# EAGLE design mailbox-notifier (EAGLE 9.5.1)
CNAME: PepeTech; CREVISION: 2.0; DESIGNER: Joao Silva

## Sheet 1 of 4: Power
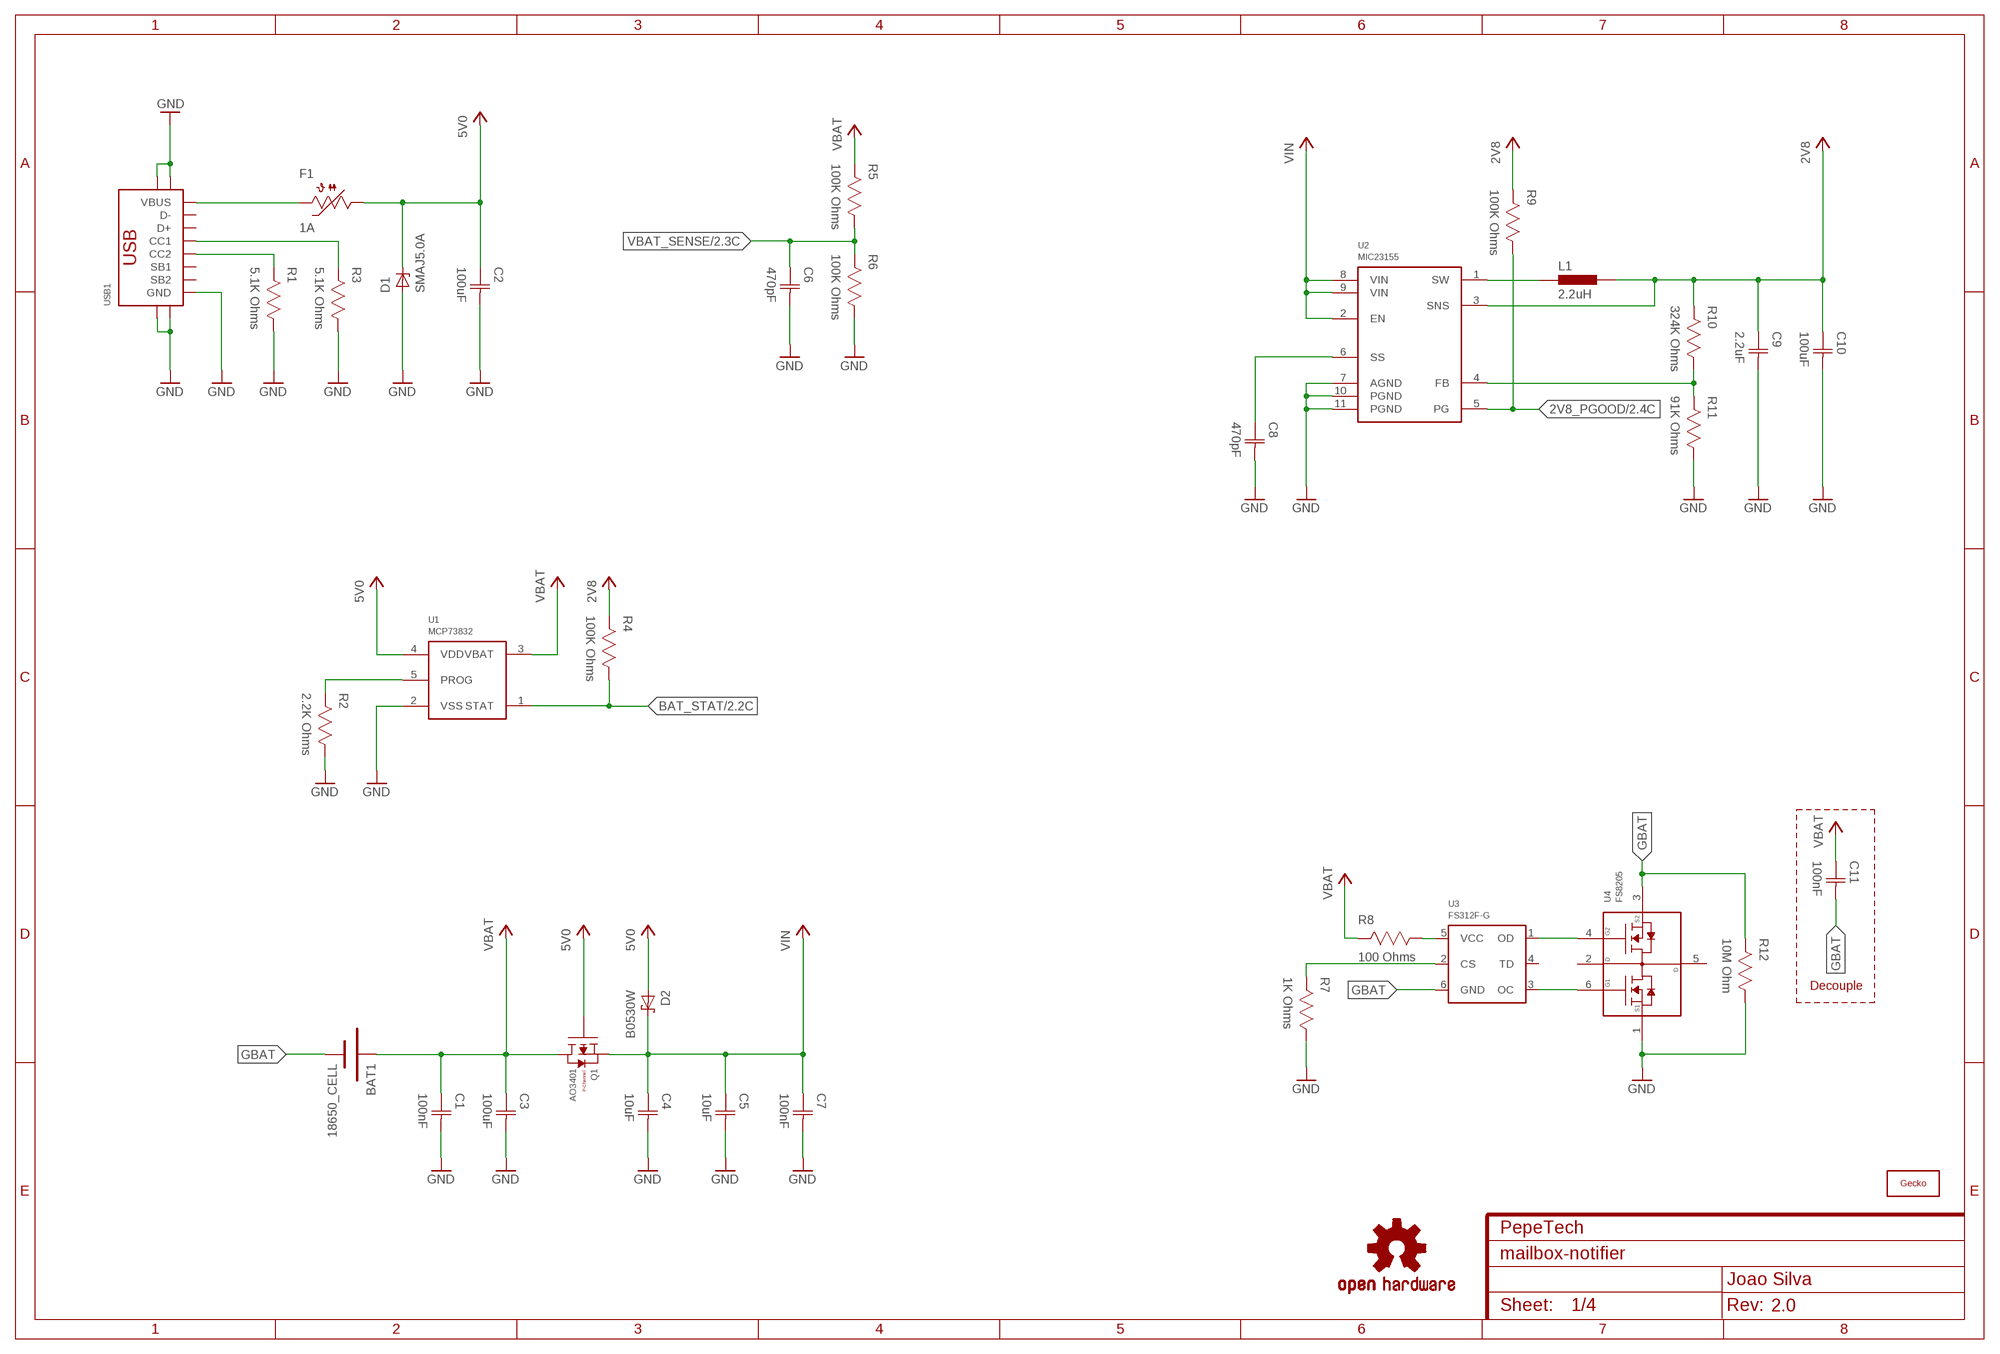
[diagram p0: schematic, sheet 1]

### Parts
BAT1  18650_CELL  [18650]
C1  100nF  CAPACITOR-0603  [CAP0603]
C2  100uF  CAPACITOR-1206  [CAP1206]
C3  100uF  CAPACITOR-1206  [CAP1206]
C4  10uF  CAPACITOR-0603  [CAP0603]
C5  10uF  CAPACITOR-0603  [CAP0603]
C6  470pF  CAPACITOR-0603  [CAP0603]
C7  100nF  CAPACITOR-0603  [CAP0603]
C8  470pF  CAPACITOR-0603  [CAP0603]
C9  2.2uF  CAPACITOR-0603  [CAP0603]
C10  100uF  CAPACITOR-1206  [CAP1206]
C11  100nF  CAPACITOR-0603  [CAP0603]
D1  SMAJ5.0A  [DO214AC]
D2  B0530W  [SOD-123]
F1  1A Hold  PTC1206  [1206]
L1  2.2uH  INDUCTOR-0805  [IND0805]
LOGO1  GECKO-14MM  [GECKO_14MM]
LOGO2  OSHW-LOGOM  [OSHW-LOGO-M]
Q1  AO3401  [SOT23]
R1  5.1K Ohms  RESISTOR-0603  [RES0603]
R2  2.2K Ohms  RESISTOR-0603  [RES0603]
R3  5.1K Ohms  RESISTOR-0603  [RES0603]
R4  100K Ohms  RESISTOR-0603  [RES0603]
R5  100K Ohms  RESISTOR-0603  [RES0603]
R6  100K Ohms  RESISTOR-0603  [RES0603]
R7  1K Ohms  RESISTOR-0603  [RES0603]
R8  100 Ohms  RESISTOR-0603  [RES0603]
R9  100K Ohms  RESISTOR-0603  [RES0603]
R10  324K Ohms  RESISTOR-0603  [RES0603]
R11  91K Ohms  RESISTOR-0603  [RES0603]
R12  10M Ohm  RESISTOR-0603  [RES0603]
U1  MCP73832  [SOT23-5]
U2  MIC23155  [DFN10]
U3  FS312F-G  [SOT23-6]
U4  FS8205  [SOT23-6]
USB1  USB-C-16P-SMD-FLAT-SIDE-TYPE-2  [USB-C-16P-SMD-FLAT-SIDE-TYPE-2]

### Nets
2V8: C9.1(C1) C10.1(C1) L1.2 R4.2 R9.2 R10.2 U2.3(SNS) ; also sheet 2,3,4
2V8_PGOOD: R9.1 U2.5(PG) ; also sheet 2
5V0: C2.1(C1) D1.C D2.A F1.1 Q1.1(G) U1.4(VDD)
BAT_STAT: R4.1 U1.1(STAT) ; also sheet 2
GBAT: BAT1.- C11.2(C2) R12.2 U3.6(GND) U4.3(S2)
GND: C1.2(C2) C2.2(C2) C3.2(C2) C4.2(C2) C5.2(C2) C6.2(C2) C7.2(C2) C8.2(C2) C9.2(C2) C10.2(C2) D1.A R1.1 R2.1 R3.1 R6.1 R7.1 R11.1 R12.1 U1.2(VSS) U2.7(AGND) U2.10(PGND) U2.11(PGND) U4.1(S1) USB1.A1/B12(GND) USB1.B1/A12(GND) USB1.SHIELD@0(SHIELD) USB1.SHIELD@1(SHIELD) USB1.SHIELD@2(SHIELD) USB1.SHIELD@3(SHIELD) ; also sheet 2,3,4
N$3: R1.2 USB1.B5(CC2)
N$4: F1.2 USB1.A4/B9(VBUS) USB1.B4/A9(VBUS)
N$5: R3.2 USB1.A5(CC1)
N$10: R2.2 U1.5(PROG)
N$12: L1.1 U2.1(SW)
N$13: R10.1 R11.2 U2.4(FB)
N$14: C8.1(C1) U2.6(SS)
N$47: U3.3(OC) U4.6(G1)
N$48: U3.1(OD) U4.4(G2)
N$49: R8.1 U3.5(VCC)
N$50: R7.2 U3.2(CS)
VBAT: BAT1.+ C1.1(C1) C3.1(C1) C11.1(C1) Q1.3(D) R5.2 R8.2 U1.3(VBAT)
VBAT_SENSE: C6.1(C1) R5.1 R6.2 ; also sheet 2
VIN: C4.1(C1) C5.1(C1) C7.1(C1) D2.C Q1.2(S) U2.2(EN) U2.8(VIN) U2.9(VIN)
Unconnected: U3.4(TD) U4.2(D12_1) U4.5(D12_2) USB1.A6(D+) USB1.A7(D-) USB1.A8(SB1) USB1.B6(D+) USB1.B7(D-) USB1.B8(SB2)

### Notes on the sheet
- Decouple

## Sheet 2 of 4: Main MCU
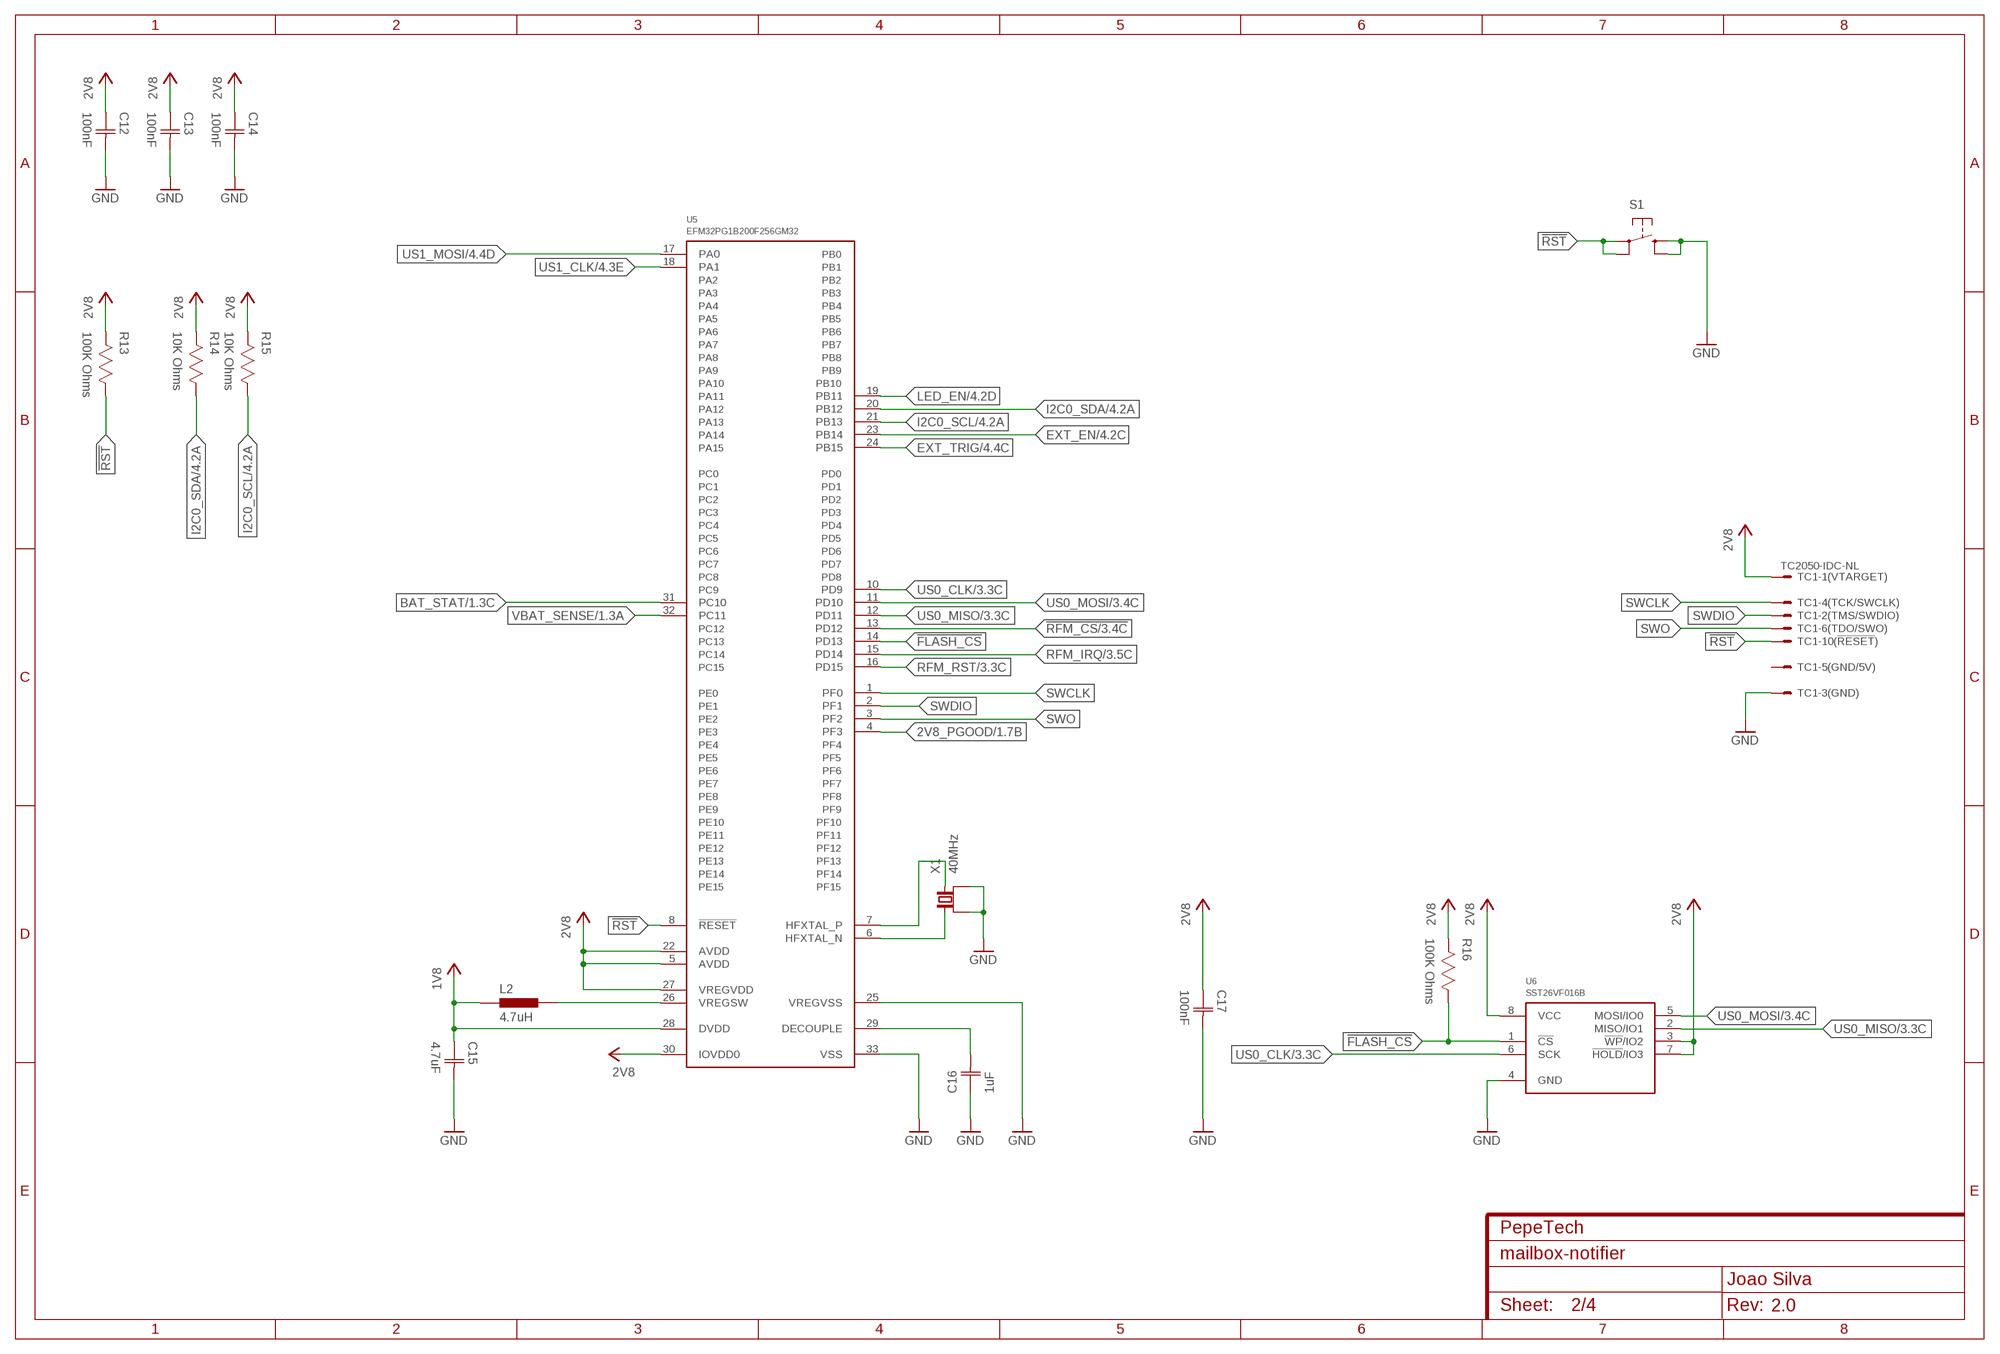
[diagram p1: schematic, sheet 2]

### Parts
C12  100nF  CAPACITOR-0603  [CAP0603]
C13  100nF  CAPACITOR-0603  [CAP0603]
C14  100nF  CAPACITOR-0603  [CAP0603]
C15  4.7uF  CAPACITOR-0603  [CAP0603]
C16  1uF  CAPACITOR-0603  [CAP0603]
C17  100nF  CAPACITOR-0603  [CAP0603]
L2  4.7uH  INDUCTOR-0603  [IND0603]
R13  100K Ohms  RESISTOR-0603  [RES0603]
R14  10K Ohms  RESISTOR-0603  [RES0603]
R15  10K Ohms  RESISTOR-0603  [RES0603]
R16  100K Ohms  RESISTOR-0603  [RES0603]
S1  TAC_SWITCHSMD  [TAC_SW_SMD_RESET]
TC1  TC2050-IDC-NL  [TC2050-IDC-NL]
U5  EFM32PG1B200F256GM32  [QFN32_0.5P]
U6  SST26VF016B  [WSOIC8]
X1  40MHz  CRYSTAL_4P  [4-SMD-3225]

### Nets
1V8: C15.1(C1) L2.1 U5.28(DVDD)
2V8: C12.1(C1) C13.1(C1) C14.1(C1) C17.1(C1) R13.2 R14.2 R15.2 R16.2 TC1.1 U5.5(AVDD) U5.22(AVDD) U5.27(VREGVDD) U5.30(IOVDD0) U6.3(!WP!/IO2) U6.7(!HOLD!/IO3) U6.8(VCC) ; also sheet 1,3,4
2V8_PGOOD: U5.4(PF3) ; also sheet 1
!FLASH_CS: R16.1 U5.14(PD13) U6.1(!CS!)
!RFM_CS: U5.13(PD12) ; also sheet 3
!RST: R13.1 S1.1 S1.2 TC1.10 U5.8(!RESET)
BAT_STAT: U5.31(PC10) ; also sheet 1
EXT_EN: U5.23(PB14) ; also sheet 4
EXT_TRIG: U5.24(PB15) ; also sheet 4
GND: C12.2(C2) C13.2(C2) C14.2(C2) C15.2(C2) C16.1(C1) C17.2(C2) S1.3 S1.4 TC1.3 U5.25(VREGVSS) U5.33(VSS) U6.4(GND) X1.1(GND) X1.3(GND) ; also sheet 1,3,4
I2C0_SCL: R15.1 U5.21(PB13) ; also sheet 4
I2C0_SDA: R14.1 U5.20(PB12) ; also sheet 4
LED_EN: U5.19(PB11) ; also sheet 4
N$16: U5.6(HFXTAL_N) X1.2
N$17: U5.7(HFXTAL_P) X1.4
N$19: L2.2 U5.26(VREGSW)
N$20: C16.2(C2) U5.29(DECOUPLE)
RFM_IRQ: U5.15(PD14) ; also sheet 3
RFM_RST: U5.16(PD15) ; also sheet 3
SWCLK: TC1.4 U5.1(PF0)
SWDIO: TC1.2 U5.2(PF1)
SWO: TC1.6 U5.3(PF2)
US0_CLK: U5.10(PD9) U6.6(SCK) ; also sheet 3
US0_MISO: U5.12(PD11) U6.2(MISO/IO1) ; also sheet 3
US0_MOSI: U5.11(PD10) U6.5(MOSI/IO0) ; also sheet 3
US1_CLK: U5.18(PA1) ; also sheet 4
US1_MOSI: U5.17(PA0) ; also sheet 4
VBAT_SENSE: U5.32(PC11) ; also sheet 1
Unconnected: TC1.5 TC1.7 TC1.8 TC1.9

## Sheet 3 of 4: ISM Radio
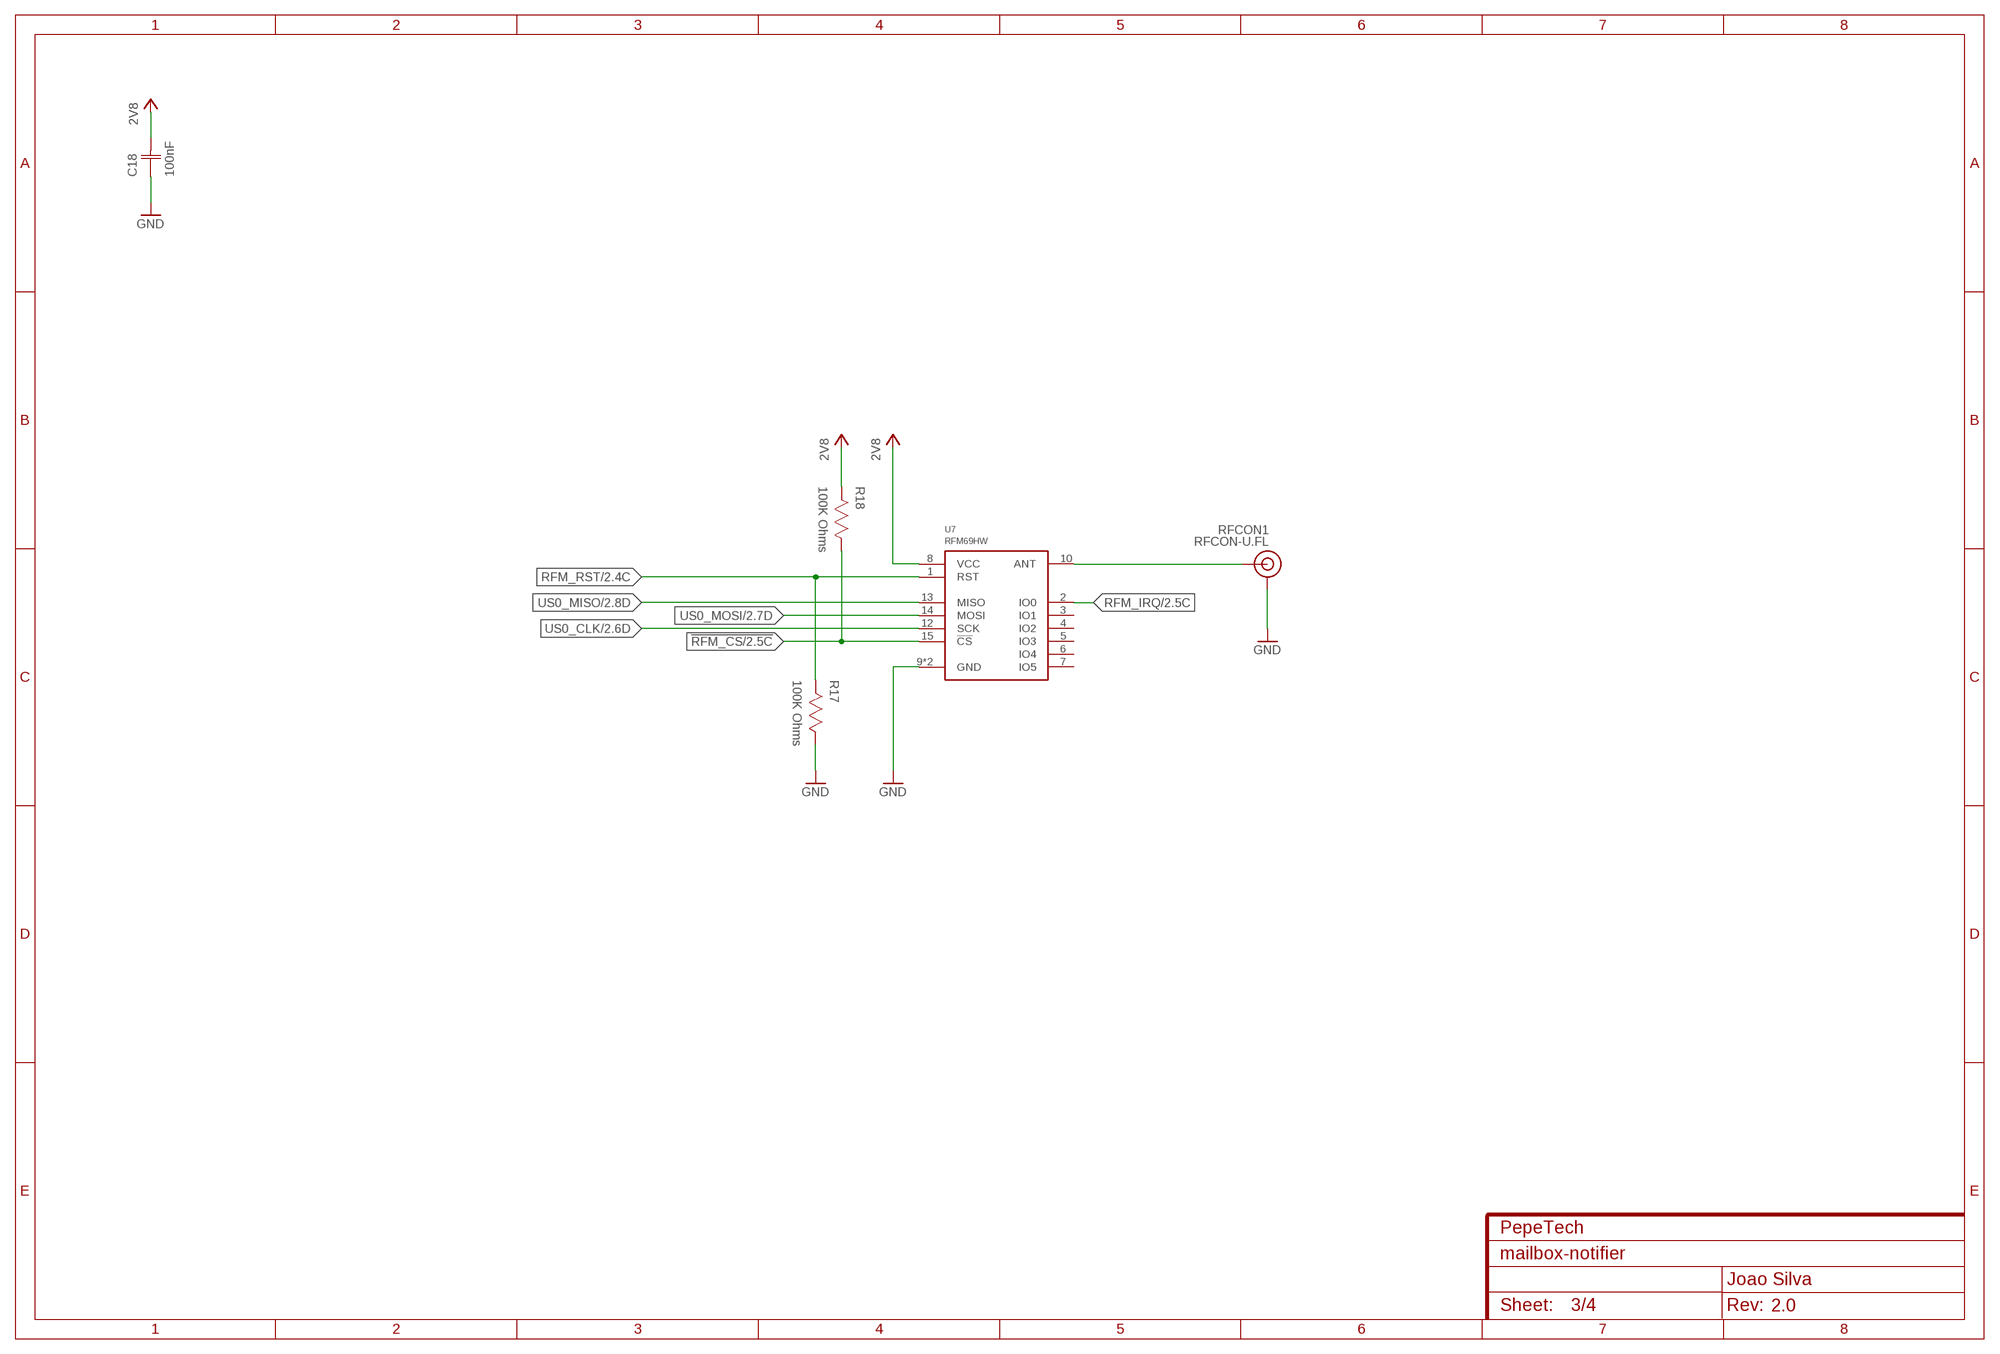
[diagram p2: schematic, sheet 3]

### Parts
C18  100nF  CAPACITOR-0603  [CAP0603]
R17  100K Ohms  RESISTOR-0603  [RES0603]
R18  100K Ohms  RESISTOR-0603  [RES0603]
RFCON1  RFCON-U.FL  [U.FL]
U7  RFM69HW  [RFM69XW-XXXS2]

### Nets
2V8: C18.2(C2) R18.2 U7.8(VCC) ; also sheet 1,2,4
!RFM_CS: R18.1 U7.15(!CS) ; also sheet 2
GND: C18.1(C1) R17.1 RFCON1.P$1(GND) RFCON1.P$2(GND) U7.9(GND) U7.11(GND) ; also sheet 1,2,4
N$1: RFCON1.P$3(SIGNAL) U7.10(ANT)
RFM_IRQ: U7.2(IO0) ; also sheet 2
RFM_RST: R17.2 U7.1(RST) ; also sheet 2
US0_CLK: U7.12(SCK) ; also sheet 2
US0_MISO: U7.13(MISO) ; also sheet 2
US0_MOSI: U7.14(MOSI) ; also sheet 2
Unconnected: U7.3(IO1) U7.4(IO2) U7.5(IO3) U7.6(IO4) U7.7(IO5)

## Sheet 4 of 4: Sensors/Interface
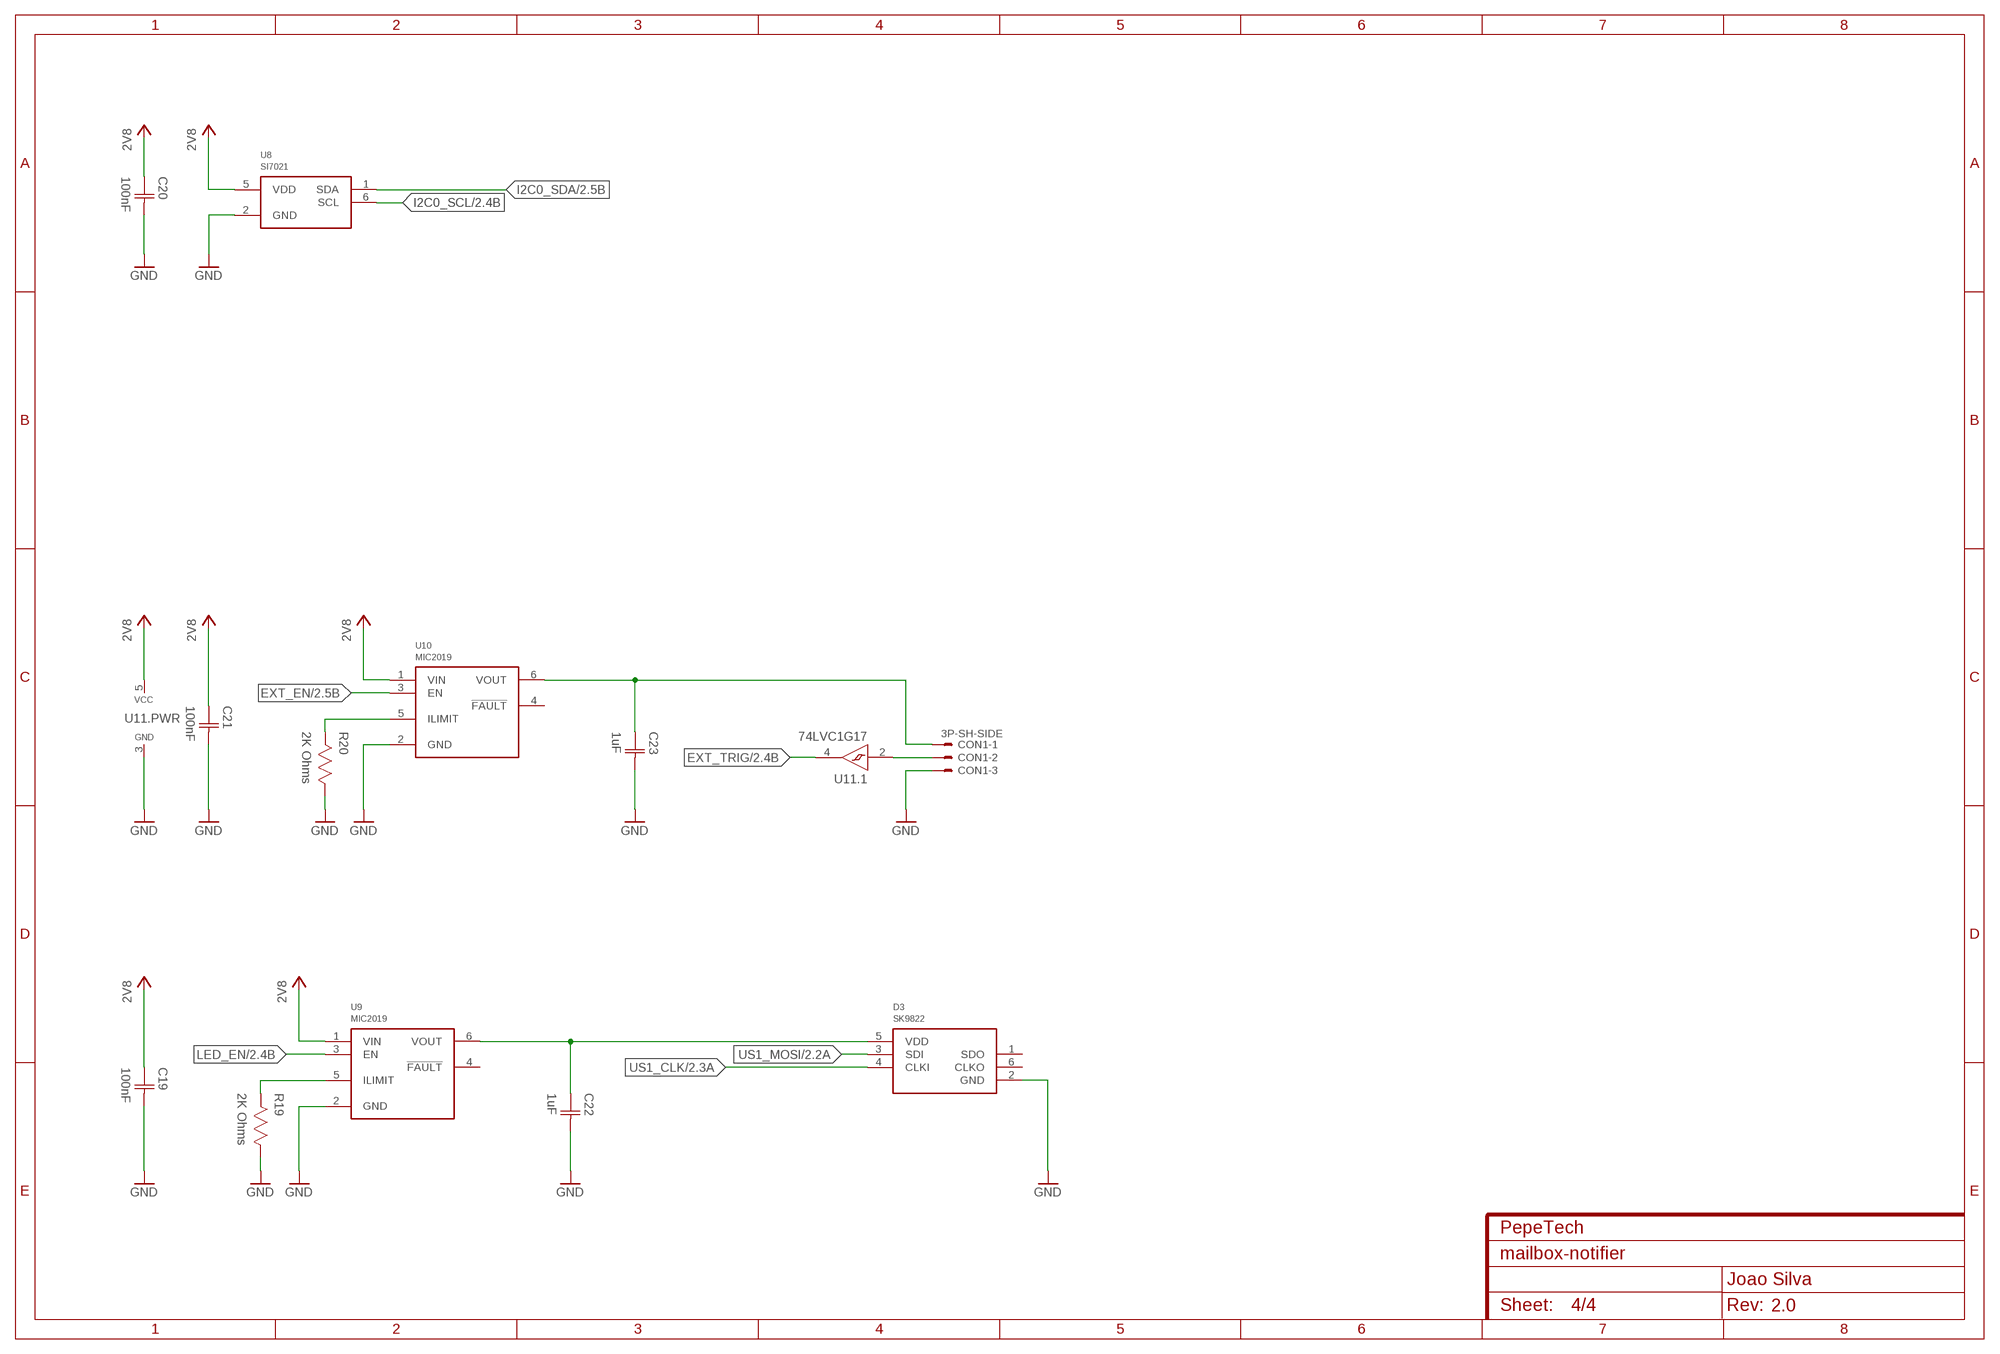
[diagram p3: schematic, sheet 4]

### Parts
C19  100nF  CAPACITOR-0603  [CAP0603]
C20  100nF  CAPACITOR-0603  [CAP0603]
C21  100nF  CAPACITOR-0603  [CAP0603]
C22  1uF  CAPACITOR-0603  [CAP0603]
C23  1uF  CAPACITOR-0603  [CAP0603]
CON1  3P-SH-SIDE  [SH-03-SIDE]
D3  SK9822  [2020]
R19  2K Ohms  RESISTOR-0603  [RES0603]
R20  2K Ohms  RESISTOR-0603  [RES0603]
U8  SI7021  [DFN6]
U9  MIC2019  [SOT23-6]
U10  MIC2019  [SOT23-6]
U11  74LVC1G17  [SC70-5]

### Nets
2V8: C19.1(C1) C20.1(C1) C21.1(C1) U8.5(VDD) U9.1(VIN) U10.1(VIN) U11.5(.PWR:VCC) ; also sheet 1,2,3
EXT_EN: U10.3(EN) ; also sheet 2
EXT_TRIG: U11.4(.1:Y) ; also sheet 2
GND: C19.2(C2) C20.2(C2) C21.2(C2) C22.2(C2) C23.2(C2) CON1.3 D3.2(GND) R19.1 R20.1 U8.2(GND) U9.2(GND) U10.2(GND) U11.3(.PWR:GND) ; also sheet 1,2,3
I2C0_SCL: U8.6(SCL) ; also sheet 2
I2C0_SDA: U8.1(SDA) ; also sheet 2
LED_EN: U9.3(EN) ; also sheet 2
N$2: R20.2 U10.5(ILIMIT)
N$6: CON1.2 U11.2(.1:A)
N$7: C23.1(C1) CON1.1 U10.6(VOUT)
N$11: R19.2 U9.5(ILIMIT)
N$15: C22.1(C1) D3.5(VDD) U9.6(VOUT)
US1_CLK: D3.4(CLKI) ; also sheet 2
US1_MOSI: D3.3(SDI) ; also sheet 2
Unconnected: D3.1(SDO) D3.6(CLKO) U9.4(!FAULT) U10.4(!FAULT)

## Library data of the parts
BAT1 = Battery:18650_CELL
C1-C23 = Capacitor:CAPACITOR
CON1 = JST:3P: Disconnectable Crimp style connector, 1.0mm pitch 3 contacts
D1 = TVS:SMAJ*A: SMAJ Series TVS Diodes Source: http://www.littelfuse.com/~/media/electronics/datasheets/tvs_diodes/littelfuse_tvs_diode_smaj_datasheet.pdf.pdf; MF: Littelfuse; MPN: SMAJ5.0A; OC_FARNELL: 1827607; OC_NEWARK: 71J2029
D2 = Generic Diode:B0530W
D3 = LED:SK9822
F1 = PTC Fuses:PTC; HOLD: 1A
L1 = Inductor:INDUCTOR; OCLCSC: C139241
L2 = Inductor:INDUCTOR; OCLCSC: C281111
LOGO1 = Silkscreen:GECKO
LOGO2 = Silkscreen:OSHW-LOGO: Open-Source Hardware (OSHW) Logo This logo indicates the piece of hardware it is found on incorporates a OSHW license and/or adheres to the definition of open source hardware found here: http://freedomdefined.org/OSHW
Q1 = Alpha Omega:AO3401
R1-R20 = Resistor:RESISTOR
RFCON1 = RF Connector:RFCON
S1 = Switch:TAC_SWITCH: Momentary Switch Button commonly used for reset or general input. Spark Fun Electronics SKU : COM-00097
TC1 = TagConnect:TC2050-IDC
U1 = Microchip:MCP7383*
U2 = Microchip:MIC23155
U3 = Fortune:FS312F-G
U4 = Fortune:FS8205
U5 = EFM32:EFM32PG1B200F*M32
U6 = Microchip:SST26VF016B
U7 = HopeRF:RFM69*
U8 = Silicon Labs:SI7021
U9 U10 = Microchip:MIC20*9
U11 = Logic:74LVC1G17
USB1 = USB Connector:USB-C-16P-SMD-FLAT-SIDE
X1 = Crystal:CRYSTAL_4P

## Board
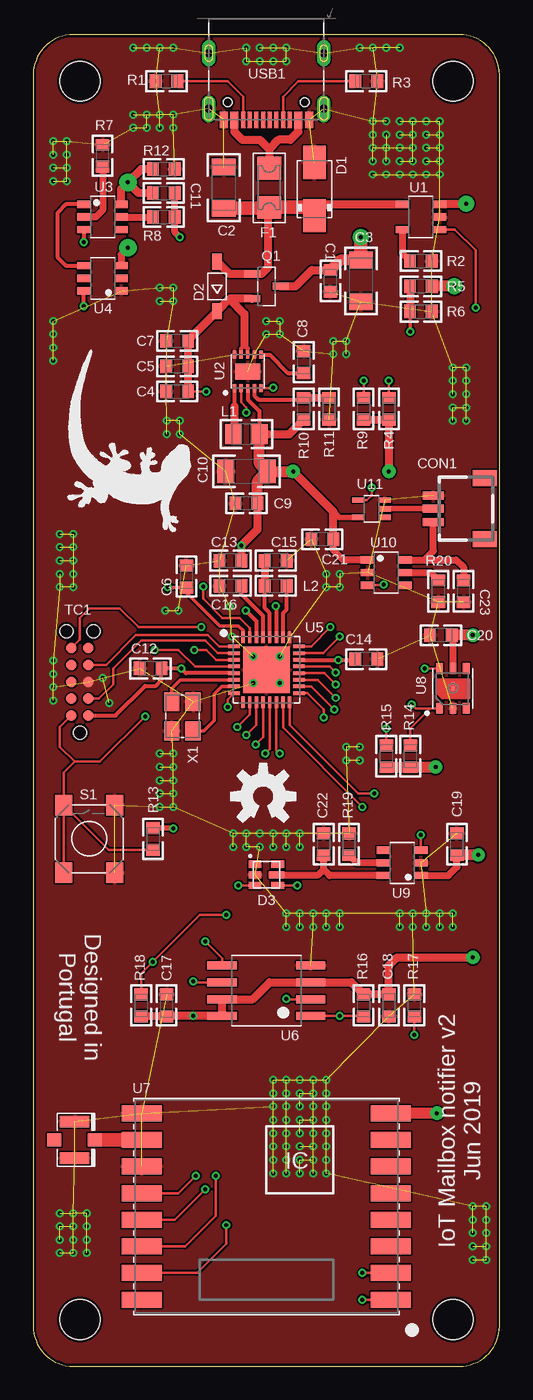
[diagram p4: board, top side]
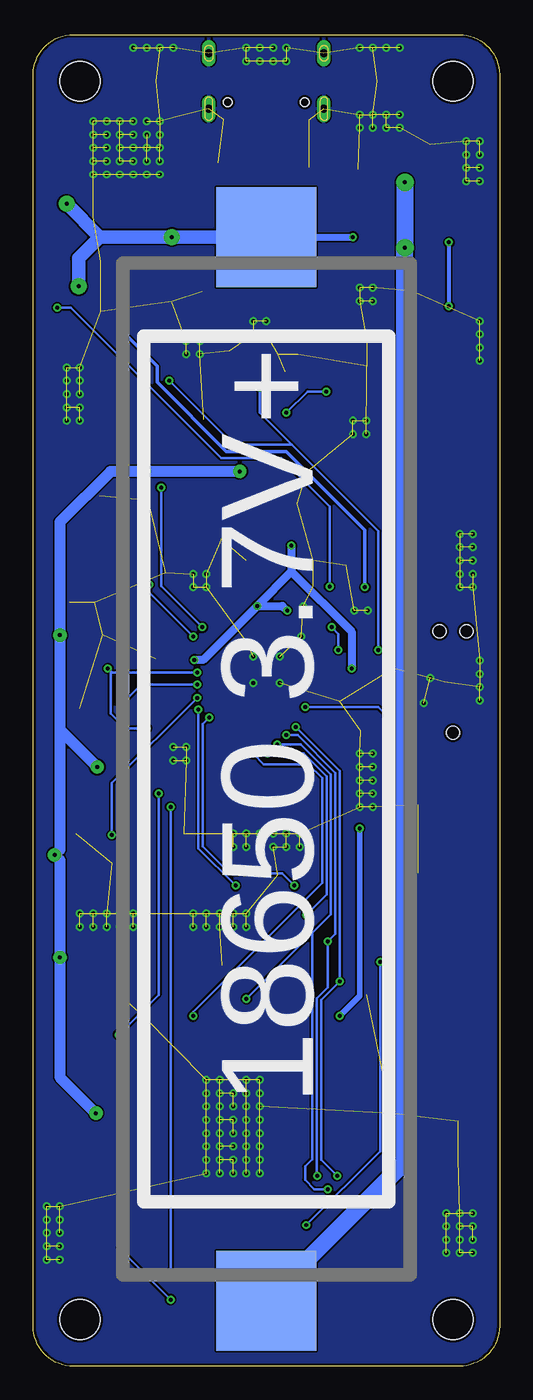
[diagram p5: board, bottom side, seen from below]

Size 35 x 100 mm. Coordinates in mm from the lower left corner, seen from the top.
Outline: 0,97 0,3 arc90 3,0 32,0 arc90 35,3 35,97 arc90 32,100 3,100 arc90 0,97
Copper layers (1*16): Top 0.035mm / dielectric 1.6mm / Bottom 0.035mm
Design rules "jlcpcb_2layer": minimum track width 5mil, minimum drill 0.3mm, track to track 5mil, track to pad 5mil, pad to pad 5mil, via to via 5mil, smd to smd 5mil, copper to edge 0.2mm, drill to drill 5mil, minimum pad ring 3mil, minimum via ring 3mil, stop-mask expansion 0.075mm, vias tented up to drill 10mm, thermal gap 5mil
Holes 3 mm at 3.5,96.5 31.5,96.5 3.5,3.5 31.5,3.5

### Footprints (pad centres in the part's own frame; a part is rotated, then mirrored left to right if it is on the bottom)
18650 = smd 7.5 x 7.5: + 0,79.9; - 0,0
CAP0603 = smd 0.889 x 1.016: 1 -0.819,0; 2 0.819,0
CAP1206 = smd 1.27 x 1.778: 1 -1.549,0; 2 1.549,0
SH-03-SIDE = smd 0.6 x 1.55: 1 -1,2.975; 2 0,2.975; 3 1,2.975 | smd 1.2 x 1.8: FIT@1 -2.3,-0.9; FIT@2 2.3,-0.9
DO214AC = smd 2.5 x 1.7: A 2,0; C -2,0
SOD-123 = smd 1.2 x 0.7: A 1.85,0; C -1.85,0
2020 = smd 0.95 x 0.55: 1 -0.85,0.8; 2 -0.85,0; 3 -0.85,-0.8; 4 0.85,-0.8; 6 0.85,0.8 | smd 1.15 x 0.55: 5 0.75,0
1206 = smd 1.7 x 1.803: 1 -1.472,0; 2 1.472,0
IND0805 = smd 1.245 x 1.473: 1 -0.965,0; 2 0.965,0
IND0603 = smd 0.889 x 1.016: 1 -0.819,0; 2 0.819,0
SOT23 = smd 1.219 x 0.533: 1 -1.067,0.94; 2 -1.067,-0.94; 3 1.067,0
RES0603 = smd 0.889 x 1.016: 1 -0.819,0; 2 0.819,0
U.FL = smd 2.2 x 0.85: P$1 0,1.375; P$2 0,-1.375 | smd 1.05 x 1: P$3 1.525,0; P$4 -1.525,0
TAC_SW_SMD_RESET = smd 1.524 x 1.27: 1 -2.54,1.905; 2 2.54,1.905; 3 -2.54,-1.905; 4 2.54,-1.905
TC2050-IDC-NL = smd 0.787 x 0.787: 1 -2.54,-0.635; 2 -1.27,-0.635; 3 0,-0.635; 4 1.27,-0.635; 5 2.54,-0.635; 6 2.54,0.635; 7 1.27,0.635; 8 0,0.635; 9 -1.27,0.635; 10 -2.54,0.635 | hole 0.991: -3.81,0; 3.81,1.016; 3.81,-1.016
SOT23-5 = smd 1 x 0.55: 1 -1.4,0.95; 2 -1.4,0; 3 -1.4,-0.95; 4 1.4,-0.95; 5 1.4,0.95
DFN10 = smd 0.6 x 0.25: 1 -1.25,1; 2 -1.25,0.5; 3 -1.25,0; 4 -1.25,-0.5; 5 -1.25,-1; 6 1.25,-1; 7 1.25,-0.5; 8 1.25,0; 9 1.25,0.5; 10 1.25,1 | smd 1.2 x 1.9: 11 0,0
SOT23-6 = smd 1 x 0.55: 1 -1.4,0.95; 2 -1.4,0; 3 -1.4,-0.95; 4 1.4,-0.95; 5 1.4,0; 6 1.4,0.95
QFN32_0.5P = smd 0.86 x 0.26: 1 -2.43,1.75; 2 -2.43,1.25; 3 -2.43,0.75; 4 -2.43,0.25; 5 -2.43,-0.25; 6 -2.43,-0.75; 7 -2.43,-1.25; 8 -2.43,-1.75; 17 2.43,-1.75; 18 2.43,-1.25; 19 2.43,-0.75; 20 2.43,-0.25; 21 2.43,0.25; 22 2.43,0.75; 23 2.43,1.25; 24 2.43,1.75 | smd 0.26 x 0.86: 9 -1.75,-2.43; 10 -1.25,-2.43; 11 -0.75,-2.43; 12 -0.25,-2.43; 13 0.25,-2.43; 14 0.75,-2.43; 15 1.25,-2.43; 16 1.75,-2.43; 25 1.75,2.43; 26 1.25,2.43; 27 0.75,2.43; 28 0.25,2.43; 29 -0.25,2.43; 30 -0.75,2.43; 31 -1.25,2.43; 32 -1.75,2.43 | smd 3.5 x 3.5: 33 0,0
WSOIC8 = smd 0.6 x 2.2: 1 -1.905,-3.33; 2 -0.635,-3.33; 3 0.635,-3.33; 4 1.905,-3.33; 5 1.905,3.33; 6 0.635,3.33; 7 -0.635,3.33; 8 -1.905,3.33
RFM69XW-XXXS2 = smd 3 x 1.2: 1 -9.35,7; 2 -9.35,5; 3 -9.35,3; 4 -9.35,1; 5 -9.35,-1; 6 -9.35,-3; 7 -9.35,-5; 8 -9.35,-7; 9 9.35,-7; 10 9.35,-5; 11 9.35,-3; 12 9.35,-1; 13 9.35,1; 14 9.35,3; 15 9.35,5; 16 9.35,7
DFN6 = smd 0.8 x 0.5: 1 1.5,-1; 2 1.5,0; 3 1.5,1; 4 -1.5,1; 5 -1.5,0; 6 -1.5,-1 | smd 0.2 x 0.2: 7 0,0
SC70-5 = smd 0.4 x 0.9: 1 -0.65,-1; 2 0,-1; 3 0.65,-1; 4 0.65,1; 5 -0.65,1
USB-C-16P-SMD-FLAT-SIDE-TYPE-2 = smd 1.25 x 0.6: A1/B12 5,3.2; A4/B9 5,2.4; B1/A12 5,-3.2; B4/A9 5,-2.4 | smd 1.25 x 0.3: A5 5,1.25; A6 5,0.25; A7 5,-0.25; A8 5,-1.25; B5 5,-1.75; B6 5,-0.75; B7 5,0.75; B8 5,1.75 | drill 0.6 pad 1 long: SHIELD@0 0,4.32; SHIELD@1 4.18,4.32; SHIELD@2 4.18,-4.32; SHIELD@3 0,-4.32 | hole 0.65: 3.68,2.89; 3.68,-2.89
4-SMD-3225 = smd 1.4 x 1.15: 1 -1.1,0.8; 2 1.1,0.8; 3 1.1,-0.8; 4 -1.1,-0.8

### Placement (x,y rotation side)
BAT1  17.5,4.9 0 bottom
C1  22.3,81.5 270 top
C2  14.3,88.5 90 top
C3  24.6,81.5 270 top
C4  10.8,73.2 180 top
C5  10.8,75.1 180 top
C6  11.5,59.3 90 top
C7  10.8,77 180 top
C8  20.3,75.4 90 top
C9  16,64.8 180 top
C10  16,67.2 180 top
C11  9.8,88.1 180 top
C12  8.8,52.4 180 top
C13  14.8,60.5 180 top
C14  25,53.1 0 top
C15  18.2,60.5 0 top
C16  14.8,58.6 0 top
C17  10,27.1 90 top
C18  26.7,27.1 90 top
C19  31.8,39.2 90 top
C20  30.6,54.9 180 top
C21  21.7,62.1 180 top
C22  21.8,39.2 90 top
C23  32.3,58.2 270 top
CON1  33,64.4 90 top
D1  21.1,88.4 90 top
D2  13.8,81.1 90 top
D3  17.5,36.9 0 top
F1  17.7,88.5 90 top
L1  16,70 0 top
L2  18.2,58.6 0 top
LOGO1  7.2,66.5 270 top
LOGO2  17.25,42.8 0 top
Q1  17.5,81.1 0 top
R1  10,96.5 0 top
R2  29.1,83 180 top
R3  25,96.5 180 top
R4  26.7,71.9 270 top
R5  29.1,81.1 0 top
R6  29.1,79.2 180 top
R7  5.2,90.9 270 top
R8  9.8,86.3 0 top
R9  24.8,71.9 270 top
R10  20.3,71.9 270 top
R11  22.2,71.9 90 top
R12  9.8,89.9 180 top
R13  9,39.6 90 top
R14  28.3,45.8 270 top
R15  26.5,45.8 270 top
R16  24.8,27.1 90 top
R17  28.6,27.1 270 top
R18  8.1,27.1 270 top
R19  23.7,39.2 270 top
R20  30.4,58.2 90 top
RFCON1  3.1,17 0 top
S1  4.2,39.6 90 top
TC1  3.5,51.4 90 top
U1  29.1,86.3 180 top
U2  16.1,74.7 90 top
U3  5.2,86.3 0 top
U4  5.2,81.7 180 top
U5  17.5,52.3 0 top
U6  17.5,28.2 90 top
U7  17.5,12 180 top
U8  31.5,50.9 270 top
U9  27.7,37.8 180 top
U10  26.5,59.6 0 top
U11  25.4,64.4 90 top
USB1  17.5,98.6 270 top
X1  11.2,48.8 90 top

### Tracks (layer width: path | path; a pad name or v marks a point on that pad's centre or on a via)
1V8
  Top 0.305: U5.28 17.75,56.55 17.38,56.92 L2.1
  Top 0.61: C15.1 L2.1
2V8  (via drill 0.3, 0.3 pad 1)
  Top 0.305: U2.3 16.1,72.6 16.96,71.73 L1.2 | U5.5 11.45,52.05 v11.1,52.4 C12.1 9.62,51.52 9.2,51.1 8.4,51.1 6.16,48.86 TC1.1 | U5.22 v22.9,53.05 24.13,53.05 C14.1 | v18.2,57.1 18.25,57.05 U5.27 | v15.95,56.75 16.75,55.95 U5.30
  Top 0.406: 22.52,63.12 C21.1 | 22.52,64.18 22.95,63.75 U11.5 | v10.5,40.4 10.48,40.42 R13.2
  Top 0.508: U10.1 23.25,60.55 22.52,61.28 C21.1 | U9.1 31.17,36.85 31.8,37.48 C19.1 | C20.1 31.5,54.82 U8.5
  Top 0.61: L1.2 19.22,70 R10.2 | 10.01,26.3 v12,26.3 U6.8 U6.7 16.46,27.57 17.73,28.84 U6.3 23.88,28.84 R16.2 C18.2 26.7,30.1 27.3,30.7 v33,30.7 | 10.01,26.3 C17.1 | R18.2 8.11,26.3 10.01,26.3 | C21.1 22.52,64.18 v19.5,67.2 | C9.1 16.82,62.82 v15.62,61.62 C13.1 | R9.2 R4.2 v26.7,67.2
  Top 0.813: C10.1 16.96,67.78 L1.2 | C9.1 16.82,66.47 C10.1 | C10.1 v19.5,67.2 | v33,54.9 C20.1 | v30.2,45 30.18,44.98 R14.2 R15.2 | v33.4,38.4 33.38,38.38 C19.1 | v30.3,19 U7.8
  Bottom 0.406: v12,26.3 10.5,27.8 v10.5,40.4
  Bottom 0.61: v15.62,61.62 15.62,59.68 | 15.62,59.68 v18.2,57.1 | 15.62,59.68 11.1,55.16 v11.1,52.4 | v18.2,57.1 22.25,53.05 v22.9,53.05 | v18.2,57.1 16.3,57.1 v15.95,56.75
  Bottom 0.813: v19.5,67.2 v26.7,67.2 29.2,67.2 33,63.4 v33,54.9 33,47.8 | 33,47.8 v30.2,45 | 33,47.8 33,38.8 v33.4,38.4 33,38 v33,30.7 33,21.7 v30.3,19
2V8_PGOOD  (via drill 0.3)
  Top 0.2: U5.4 12.15,52.55 10.9,53.8 v9.1,53.8 | v24.8,74 R9.1 | v18,73.5 17.95,73.45 U2.5
  Bottom 0.2: v9.1,53.8 9.1,62.7 15.6,69.2 | 15.6,69.2 20,69.2 v24.8,74 | 15.6,69.2 18,71.6 v18,73.5
5V0
  Top 0.61: 17.62,86.95 17.62,82.52 17.14,82.04 Q1.1 14.71,82.04 D2.A | D1.C 21.95,87.25 U1.4
  Top 1.016: C2.1 17.62,86.95 F1.1 20.47,87.03 D1.C
!FLASH_CS  (via drill 0.3)
  Top 0.2: U6.1 v23,26.3 24.79,26.3 R16.1 | U5.14 18.25,46.25 v18.5,46
  Bottom 0.2: v18.5,46 17.7,45.2 14.35,45.2 13.31,44.16 13.31,36.29 23,26.6 v23,26.3
!RFM_CS  (via drill 0.3)
  Top 0.2: U5.13 17.75,46.35 v17.4,46 | v14.5,33.9 12.5,33.9 v8.95,30.35 8.1,29.5 R18.1 | v14.5,10.6 14.5,9.2 12.3,7 U7.15
  Bottom 0.2: v17.4,46 14.69,46 12.98,44.29 12.98,35.42 v14.5,33.9 | v8.95,30.35 8.95,16.15 v14.5,10.6
!RST  (via drill 0.3)
  Top 0.2: U5.8 14.6,50.08 v14.6,49.5 | v8.4,48.8 5,45.4 3.1,45.4 | 3.1,45.4 2,46.5 2,48 TC1.10 | 3.1,45.4 2.29,44.59 S1.2 | S1.1 S1.2 | R13.1 5.65,38.78 S1.2
  Bottom 0.2: v14.6,49.5 9.1,49.5 v8.4,48.8
BAT_STAT  (via drill 0.3)
  Top 0.2: U5.31 16.25,55.45 15.5,56.2 14.2,56.2 12.75,57.65 v12.75,58.55 | v26.7,74 R4.1 | v33.2,79.5 33.2,83.8 31.65,85.35 U1.1
  Bottom 0.2: v12.75,58.55 12.75,64.55 16.4,68.2 20.9,68.2 v26.7,74 32.2,79.5 v33.2,79.5
EXT_EN  (via drill 0.3)
  Top 0.2: U5.23 21.75,53.55 v23,54.8 | v26.3,58.7 26.25,58.65 U10.3
  Bottom 0.2: v23,54.8 26.3,58.1 v26.3,58.7
EXT_TRIG  (via drill 0.3)
  Top 0.2: U5.24 20.85,54.05 v22.3,55.5 | v25.4,66 25.4,65.4 25.05,65.05 U11.4
  Bottom 0.2: v22.3,55.5 25.4,58.6 v25.4,66
GBAT  (via drill 0.3 pad 1.3)
  Top 0.508: v7.1,84 6.6,83.5 U4.3
  Top 0.61: U3.6 6.6,88.4 v7.1,88.9 | C11.2 7.9,88.1 v7.1,88.9 | R12.2 8.1,89.9 v7.1,88.9
  Bottom 0.508: 7.1,84.3 v7.1,84
  Bottom 1.27: BAT1.- 7.1,15.3 v7.1,84 | v7.1,88.9 7.1,84.3
GND  (via drill 0.3)  (285 unrouted)
  Top 0.2: U5.33 v18.5,53.3 | U5.33 v16.5,53.3 | U5.33 v16.5,51.3 | U5.33 v18.5,51.3
  other vias: 5.7,49.8 5.2,51.7 30.5,93.5 30.5,92.5 30.5,91.5 30.5,90.5 30.5,89.5 29.5,90.5 29.5,89.5 28.5,89.5 27.5,89.5 26.5,89.5 25.5,89.5 25.5,90.5 25.5,91.5 25.5,92.5 25.5,93.5 26.5,93.5 26.5,92.5 26.5,91.5 26.5,90.5 27.5,90.5 28.5,90.5 28.5,91.5 28.5,92.5 28.5,93.5 29.5,93.5 29.5,92.5 29.5,91.5 27.5,91.5 27.5,92.5 27.5,93.5 19,99 19,98 18,98 16,98 17,98 17,99 18,99 16,99 10.5,94 10.5,93 9.5,93 7.5,93 8.5,93 8.5,94 9.5,94 7.5,94 1.5,92 2.5,92 2.5,91 2.5,89 2.5,90 1.5,90 1.5,91 1.5,89 32.5,75 32.5,74 32.5,73 32.5,72 32.5,71 31.5,72 31.5,71 31.5,75 31.5,74 31.5,73 3,62.5 3,61.5 3,60.5 3,59.5 3,58.5 2,59.5 2,58.5 2,62.5 2,61.5 2,60.5 10.5,46 10.5,45 10.5,44 10.5,43 10.5,42 9.5,43 9.5,42 9.5,46 9.5,45 9.5,44 18,21.5 19,21.5 20,21.5 21,21.5 22,21.5 21,20.5 22,20.5 18,20.5 19,20.5 20,20.5 18,19.5 19,19.5 20,19.5 21,19.5 22,19.5 21,18.5 22,18.5 18,18.5 19,18.5 20,18.5 18,17.5 19,17.5 20,17.5 21,17.5 22,17.5 21,16.5 22,16.5 18,16.5 19,16.5 20,16.5 18,15.5 19,15.5 20,15.5 21,15.5 22,15.5 21,14.5 22,14.5 18,14.5 19,14.5 20,14.5 33,8 33,9 33,10 33,11 33,12 34,11 34,12 34,8 34,9 34,10 27.5,34 28.5,34 29.5,34 30.5,34 31.5,34 30.5,33 31.5,33 27.5,33 28.5,33 29.5,33 19,34 20,34 21,34 22,34 23,34 22,33 23,33 19,33 20,33 21,33 15,40 16,40 15,39 16,39 23.5,46.5 24.5,46.5 23.5,45.5 24.5,45.5 22,59.5 23,59.5 22,58.5 23,58.5 10,71 11,71 10,70 11,70 9.5,81 10.5,81 9.5,80 10.5,80 17.5,78.5 18.5,78.5 17.5,77.5 18.5,77.5 22.5,77 23.5,77 22.5,76 23.5,76 2,11.5 3,11.5 4,11.5 3,10.5 4,10.5 2,10.5 2,9.5 3,9.5 4,9.5 3,8.5 4,8.5 2,8.5 19,40 20,40 19,39 20,39 17,40 18,40 17,39 18,39 27.5,99 25.5,99 26.5,99 24.5,99 10.5,99 8.5,99 9.5,99 7.5,99 1.5,78.5 1.5,76.5 1.5,77.5 1.5,75.5 14.75,57.05 14.9,54.8 10.9,56.75 9.9,56.75 1.5,51 1.5,50 1.5,53 1.5,52
  pour Top: -2.5,102.3 41.5,102.3 41.5,-3.1 -2.5,-3.1
  pour Bottom: -3.2,102.9 42.2,102.9 42.2,-3.7 -3.2,-3.7
I2C0_SCL  (via drill 0.3)
  Top 0.2: U5.21 22.25,52.55 v22.7,52.1 | v29.4,52.4 U8.6 | R15.1 v26.5,47.9
  Bottom 0.2: v22.7,52.1 29.2,52.1 | v29.4,52.4 29.2,52.2 29.2,52.1 | v26.5,47.9 28.1,47.9 29.2,49 29.2,52.1
I2C0_SDA  (via drill 0.3)
  Top 0.2: U5.20 21.85,52.05 v22.7,51.2 | 29.8,49.4 U8.1 | R14.1 28.3,47.9 29.8,49.4 | v28.4,49.7 28.7,49.4 29.8,49.4
  Bottom 0.2: v22.7,51.2 26.9,51.2 v28.4,49.7
LED_EN  (via drill 0.3)
  Top 0.2: U5.19 21.35,51.55 v22.7,50.2 | v29.1,39.9 U9.3
  Bottom 0.2: v22.7,50.2 29.1,43.8 v29.1,39.9
N$1
  Top 1.016: U7.10 RFCON1.P$3
N$2
  Top 0.508: U10.5 29.82,59.6 R20.2
N$3
  Top 0.2: R1.2 14.6,96.5 15.75,95.35 USB1.B5
N$4
  Top 0.61: USB1.B4/A9 15.1,92.7 15.7,92.1 17,92.1 17.7,91.4 | 17.7,91.4 F1.2 | 17.7,91.4 18.4,92.1 19.3,92.1 19.9,92.7 USB1.A4/B9
N$5
  Top 0.2: R3.2 19.9,96.5 18.75,95.35 USB1.A5
N$6
  Top 0.406: CON1.2 U11.2
N$7
  Top 0.508: U10.6 29.35,60.55 | CON1.1 30.02,61.23 29.35,60.55 | 29.35,60.55 31.75,60.55 32.3,60 C23.1
N$10
  Top 0.508: U1.5 27.7,83.58 R2.2
N$11
  Top 0.508: U9.5 24.28,37.8 R19.2
N$12
  Top 0.305: U2.1 15.1,72.1
  Top 0.61: 15.1,72.1 15.1,70.06 L1.1
N$13
  Top 0.305: U2.4 16.6,72.9 16.9,72.6 20.18,72.6 R10.1
  Top 0.61: R11.2 R10.1
N$14
  Top 0.305: U2.6 17.75,75.95 19.12,74.58 C8.1
N$15
  Top 0.508: U9.6 22.25,36.85 21.8,37.3 | 21.8,37.3 C22.1 | D3.5 21.4,36.9 21.8,37.3
N$16
  Top 0.254: X1.2 10.4,50.9 11.05,51.55 U5.6
N$17
  Top 0.254: U5.7 14.15,51.05 13.6,50.5 13.6,48.5 12.8,47.7 X1.4
N$19
  Top 0.305: U5.26 18.75,56.55 19.02,56.82 L2.2
N$20
  Top 0.305: U5.29 17.25,56.35 15.62,57.98 C16.2
N$47  (via drill 0.3)
  Top 0.305: U3.3 v3.8,84.4 | v3.8,79.6 U4.6
  Bottom 0.305: v3.8,84.4 v3.8,79.6
N$48
  Top 0.305: U3.1 2.45,87.25 1.8,86.6 1.8,83.3 2.45,82.65 U4.4
N$49
  Top 0.508: U3.5 R8.1
N$50
  Top 0.508: R7.2 5.2,86.8 4.7,86.3 U3.2
RFM_IRQ  (via drill 0.3)
  Top 0.2: U5.15 18.75,47.95 v24.7,42 | v24.7,7 U7.2
  Bottom 0.2: v24.7,42 v24.7,7
RFM_RST  (via drill 0.3)
  Top 0.2: U5.16 19.25,48.15 24.4,43 v25.6,43 | v28.6,24.9 R17.2 | v24.7,5 U7.1
  Bottom 0.2: v25.6,43 25.6,27.9 v28.6,24.9 28.6,8.9 v24.7,5
SWCLK
  Top 0.2: TC1.4 5.47,52.67 7.7,54.9 13.1,54.9 13.95,54.05 U5.1
SWDIO
  Top 0.2: TC1.2 4.93,50.13 6,51.2 6,52.4 8.1,54.5 12.9,54.5 13.85,53.55 U5.2
SWO  (via drill 0.3)
  Top 0.2: U5.3 13.75,53.05 13,53.8 v12.1,53.8 | v12.6,55.5 7.9,55.5 6.5,56.9 4.2,56.9 3.5,56.2 3.5,54.58 TC1.6
  Bottom 0.2: v12.6,55.5 12.1,55 v12.1,53.8
US0_CLK  (via drill 0.3)
  Top 0.2: U5.10 16.25,48.95 v15.3,48 | v12,28.9 12.06,28.84 U6.6 | v12.2,14.3 10.9,13 U7.12
  Bottom 0.2: v15.3,48 12,44.7 v12,28.9 13.4,27.5 13.4,15.5 v12.2,14.3
US0_MISO  (via drill 0.3)
  Top 0.2: U5.12 17.25,47.25 v16.7,46.7 | v12.9,13.3 10.6,11 U7.13 | v19,27.6 19.04,27.57 U6.2
  Bottom 0.2: v16.7,46.7 14.93,46.7 12.65,44.43 12.65,33.95 14.05,32.55 | v12.9,13.3 13.9,13.3 14.6,14 14.6,15 14.05,15.55 14.05,32.55 | 14.05,32.55 v19,27.6
US0_MOSI  (via drill 0.3)
  Top 0.2: U5.11 16.75,48.15 v16,47.4 | 12.9,31.88 v12.9,31.9 14.17,30.63 U6.5 | v13.7,14.3 13.7,11.3 11.4,9 U7.14
  Bottom 0.2: v16,47.4 15.16,47.4 12.33,44.56 12.33,32.47 v12.9,31.9 12.9,28.46 13.73,27.64 13.73,14.33 v13.7,14.3
US1_CLK  (via drill 0.3)
  Top 0.2: U5.18 20.85,51.05 v22.6,49.3 | v19.8,36.1 D3.4
  Bottom 0.2: v22.6,49.3 22.6,38.9 v19.8,36.1
US1_MOSI  (via drill 0.3)
  Top 0.2: U5.17 20.55,50.55 21.8,49.3 v21.8,48.7 | v15.4,36.1 D3.3
  Bottom 0.2: v21.8,48.7 22.27,48.23 22.27,39.03 20.24,37 16.3,37 v15.4,36.1
VBAT  (via drill 0.3, 0.3 pad 1.2)
  Top 0.508: v11,84.8 10.62,85.18 R8.2 C11.1
  Top 0.61: Q1.3 19.7,81.1 20.92,82.32 C1.1 | v32.5,87.3 32.45,87.25 U1.3
  Top 0.813: C3.1 23.03,83.05 C1.1 | v31.6,81.1 R5.2
  Top 1.016: v24.6,84.8 C3.1
  Bottom 0.508: BAT1.+ v11,84.8
  Bottom 1.016: BAT1.+ v24.6,84.8 30,84.8 | 30,84.8 v32.5,87.3 | 30,84.8 31.6,83.2 v31.6,81.1
VBAT_SENSE  (via drill 0.3)
  Top 0.254: U5.32 15.75,55.25 15.4,55.6 14,55.6 11.5,58.1 C6.1 10.12,58.48 v10.1,58.5 | v28.3,77.7 28.3,79.18 R6.2
  Top 0.61: R5.1 R6.2
  Bottom 0.254: v10.1,58.5 10.1,62.8 16,68.7 20.5,68.7 25.7,73.9 25.7,75.1 v28.3,77.7
VIN  (via drill 0.3)
  Top 0.2: U2.2 15.6,72.4 16,72 v16,71.6 | v13,73.2 C4.1
  Top 0.305: U2.9 15.6,76.45 15.85,76.7 16.1,76.45 U2.8
  Top 0.61: Q1.2 14.71,80.16 | 14.71,80.16 D2.C 11.62,77.07 C7.1 C5.1 C4.1 | 14.71,80.16 15.85,79.02 15.85,76.7
  Bottom 0.2: v16,71.6 14.4,73.2 v13,73.2

### Text on the board
tPlace: Designed in / Portugal | IoT Mailbox notifier v2 / Jun 2019